# Altium schematic sheet HydrophoneGroup1FilterAndAmpCircuit.SchDoc
size C
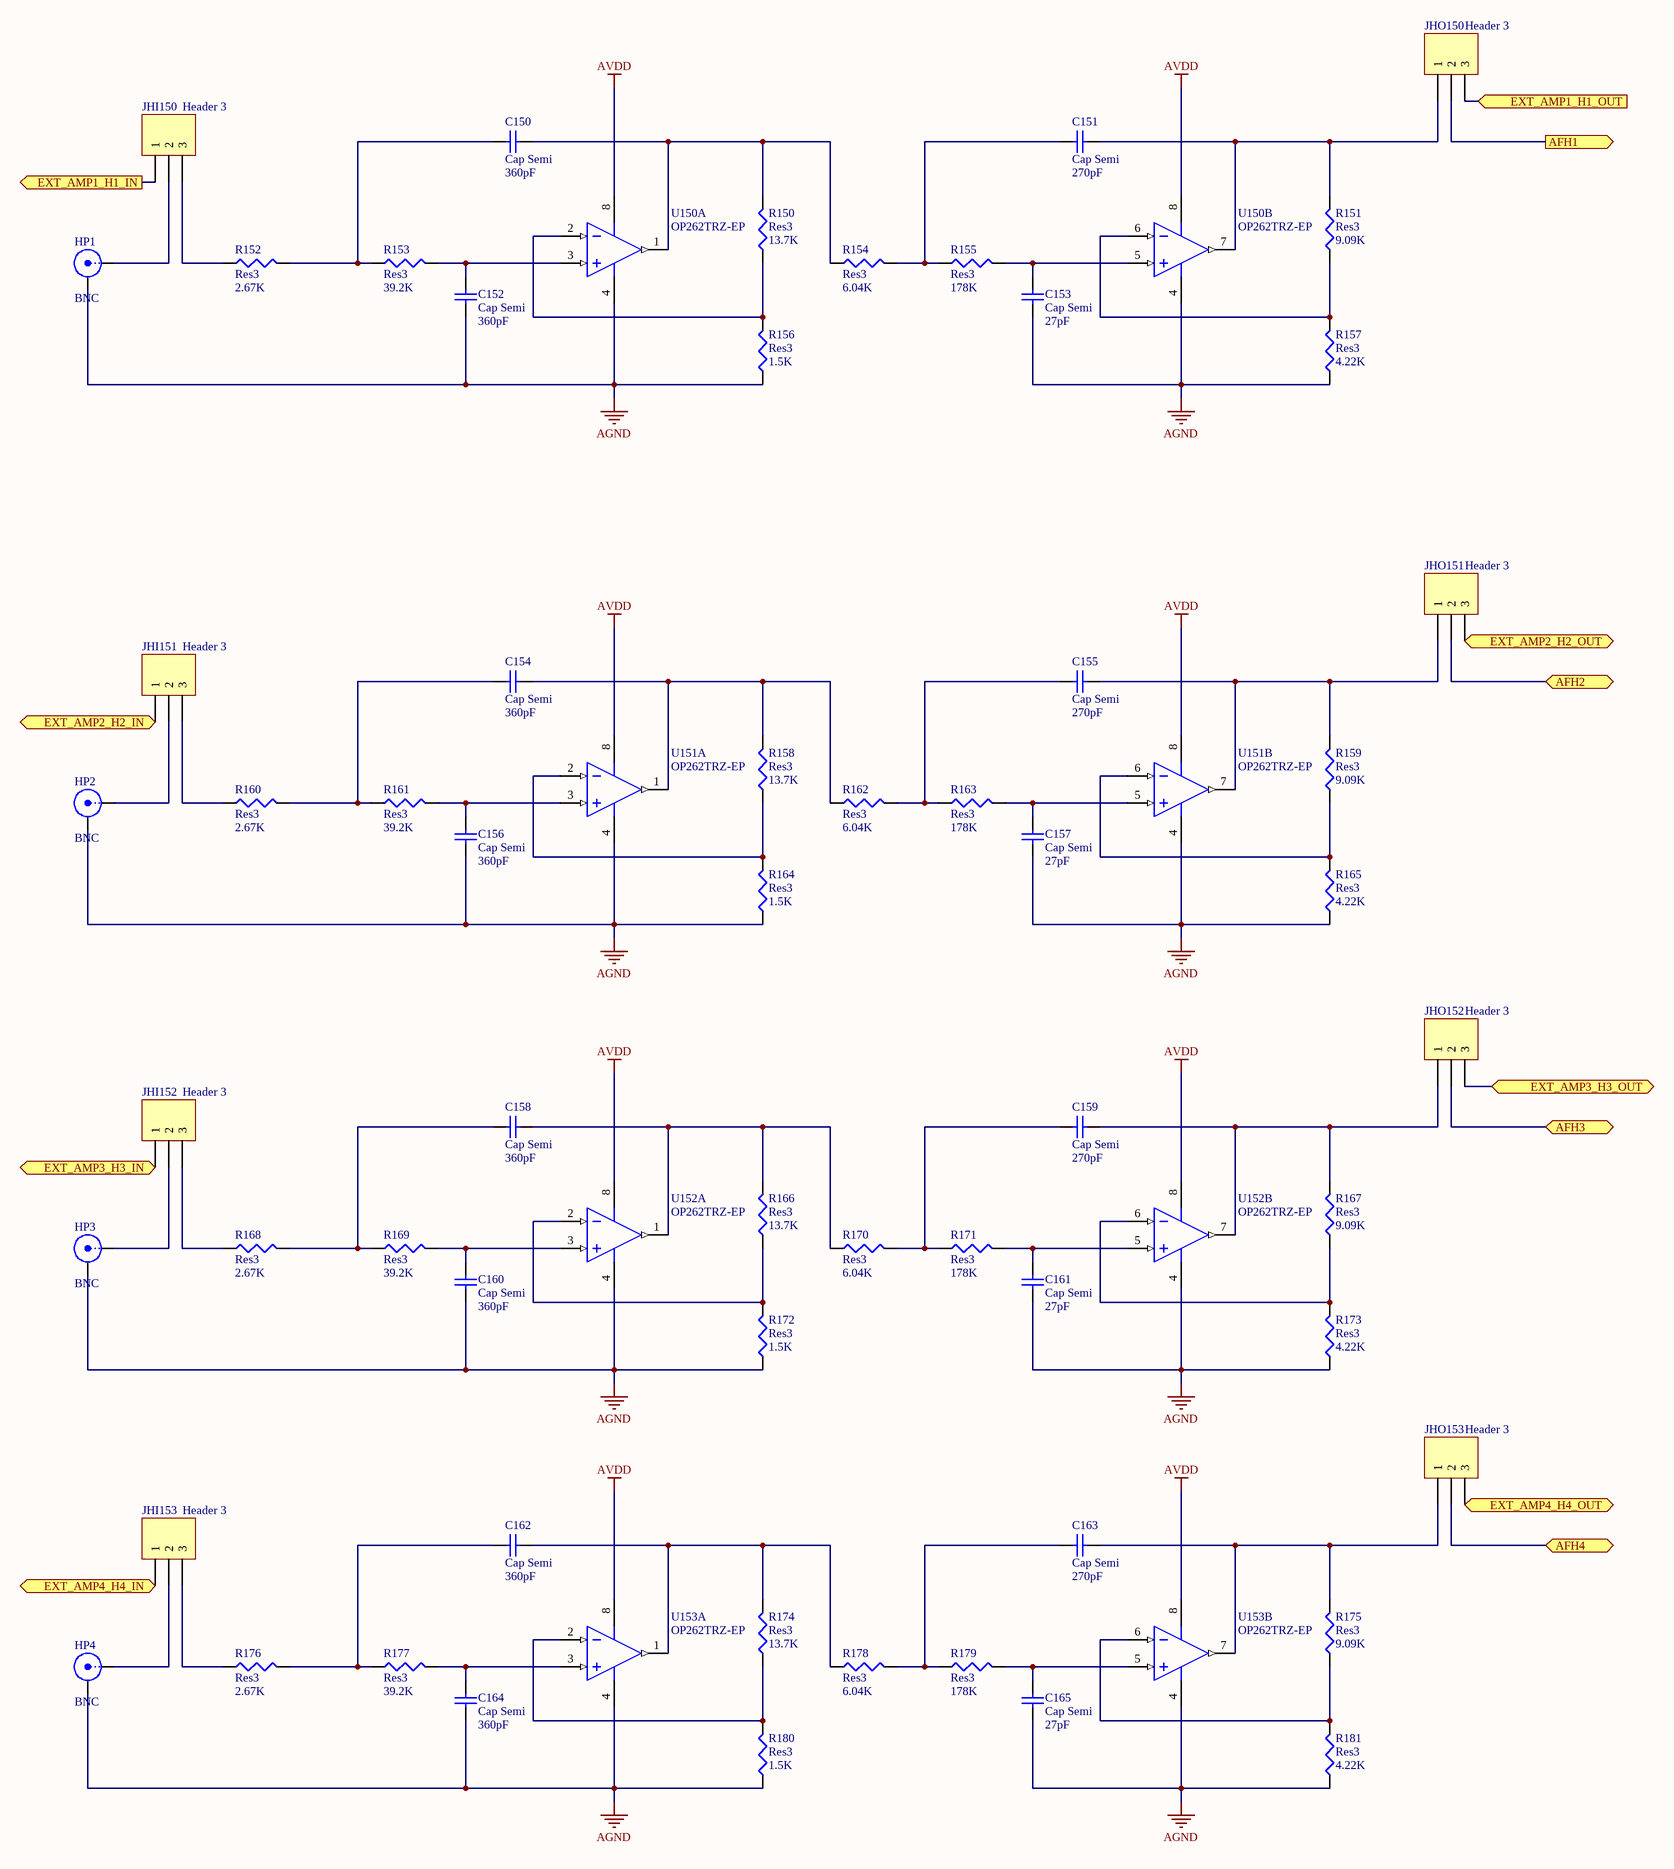
[diagram p0: HydrophoneGroup1FilterAndAmpCircuit.SchDoc]

## Parts
C150  Cap Semi  value 360pF  [1608[0603]]
C151  Cap Semi  value 270pF  [1608[0603]]
C152  Cap Semi  value 360pF  [1608[0603]]
C153  Cap Semi  value 27pF  [1608[0603]]
C154  Cap Semi  value 360pF  [1608[0603]]
C155  Cap Semi  value 270pF  [1608[0603]]
C156  Cap Semi  value 360pF  [1608[0603]]
C157  Cap Semi  value 27pF  [1608[0603]]
C158  Cap Semi  value 360pF  [1608[0603]]
C159  Cap Semi  value 270pF  [1608[0603]]
C160  Cap Semi  value 360pF  [1608[0603]]
C161  Cap Semi  value 27pF  [1608[0603]]
C162  Cap Semi  value 360pF  [1608[0603]]
C163  Cap Semi  value 270pF  [1608[0603]]
C164  Cap Semi  value 360pF  [1608[0603]]
C165  Cap Semi  value 27pF  [1608[0603]]
HP1  BNC  [BNC_RA CON]
HP2  BNC  [BNC_RA CON]
HP3  BNC  [BNC_RA CON]
HP4  BNC  [BNC_RA CON]
JHI150  Header 3  [HDR1X3]
JHI151  Header 3  [HDR1X3]
JHI152  Header 3  [HDR1X3]
JHI153  Header 3  [HDR1X3]
JHO150  Header 3  [HDR1X3]
JHO151  Header 3  [HDR1X3]
JHO152  Header 3  [HDR1X3]
JHO153  Header 3  [HDR1X3]
R150  Res3  value 13.7K  [J1-0603]
R151  Res3  value 9.09K  [J1-0603]
R152  Res3  value 2.67K  [J1-0603]
R153  Res3  value 39.2K  [J1-0603]
R154  Res3  value 6.04K  [J1-0603]
R155  Res3  value 178K  [J1-0603]
R156  Res3  value 1.5K  [J1-0603]
R157  Res3  value 4.22K  [J1-0603]
R158  Res3  value 13.7K  [J1-0603]
R159  Res3  value 9.09K  [J1-0603]
R160  Res3  value 2.67K  [J1-0603]
R161  Res3  value 39.2K  [J1-0603]
R162  Res3  value 6.04K  [J1-0603]
R163  Res3  value 178K  [J1-0603]
R164  Res3  value 1.5K  [J1-0603]
R165  Res3  value 4.22K  [J1-0603]
R166  Res3  value 13.7K  [J1-0603]
R167  Res3  value 9.09K  [J1-0603]
R168  Res3  value 2.67K  [J1-0603]
R169  Res3  value 39.2K  [J1-0603]
R170  Res3  value 6.04K  [J1-0603]
R171  Res3  value 178K  [J1-0603]
R172  Res3  value 1.5K  [J1-0603]
R173  Res3  value 4.22K  [J1-0603]
R174  Res3  value 13.7K  [J1-0603]
R175  Res3  value 9.09K  [J1-0603]
R176  Res3  value 2.67K  [J1-0603]
R177  Res3  value 39.2K  [J1-0603]
R178  Res3  value 6.04K  [J1-0603]
R179  Res3  value 178K  [J1-0603]
R180  Res3  value 1.5K  [J1-0603]
R181  Res3  value 4.22K  [J1-0603]
U150  OP262TRZ-EP  [ADI-R-8_N]  (parts A,B of 2)
U151  OP262TRZ-EP  [ADI-R-8_N]  (parts A,B of 2)
U152  OP262TRZ-EP  [ADI-R-8_N]  (parts A,B of 2)
U153  OP262TRZ-EP  [ADI-R-8_N]  (parts A,B of 2)

## Ports
AFH1 (out), AFH2, AFH3, AFH4, EXT_AMP1_H1_IN (out), EXT_AMP1_H1_OUT (in), EXT_AMP2_H2_IN, EXT_AMP2_H2_OUT, EXT_AMP3_H3_IN, EXT_AMP3_H3_OUT, EXT_AMP4_H4_IN, EXT_AMP4_H4_OUT

## Nets
AGND: C152.1 C153.1 C156.1 C157.1 C160.1 C161.1 C164.1 C165.1 HP1.2(Y) HP2.2(Y) HP3.2(Y) HP4.2(Y) R156.1 R157.1 R164.1 R165.1 R172.1 R173.1 R180.1 R181.1 U150.4(-V) U151.4(-V) U152.4(-V) U153.4(-V)
AVDD: U150.8(+V) U151.8(+V) U152.8(+V) U153.8(+V)
AFH1: JHO150.2 ; port AFH1
AFH2: JHO151.2 ; port AFH2
AFH3: JHO152.2 ; port AFH3
AFH4: JHO153.2 ; port AFH4
EXT_AMP1_H1_IN: JHI150.1 ; port EXT_AMP1_H1_IN
EXT_AMP1_H1_OUT: JHO150.3 ; port EXT_AMP1_H1_OUT
EXT_AMP2_H2_IN: JHI151.1 ; port EXT_AMP2_H2_IN
EXT_AMP2_H2_OUT: JHO151.3 ; port EXT_AMP2_H2_OUT
EXT_AMP3_H3_IN: JHI152.1 ; port EXT_AMP3_H3_IN
EXT_AMP3_H3_OUT: JHO152.3 ; port EXT_AMP3_H3_OUT
EXT_AMP4_H4_IN: JHI153.1 ; port EXT_AMP4_H4_IN
EXT_AMP4_H4_OUT: JHO153.3 ; port EXT_AMP4_H4_OUT
NetC150_1: C150.1 R152.2 R153.1
NetC150_2: C150.2 R150.2 R154.1 U150.1(OUT_A)
NetC151_1: C151.1 R154.2 R155.1
NetC151_2: C151.2 JHO150.1 R151.2 U150.7(OUT_B)
NetC152_2: C152.2 R153.2 U150.3(+IN_A)
NetC153_2: C153.2 R155.2 U150.5(+IN_B)
NetC154_1: C154.1 R160.2 R161.1
NetC154_2: C154.2 R158.2 R162.1 U151.1(OUT_A)
NetC155_1: C155.1 R162.2 R163.1
NetC155_2: C155.2 JHO151.1 R159.2 U151.7(OUT_B)
NetC156_2: C156.2 R161.2 U151.3(+IN_A)
NetC157_2: C157.2 R163.2 U151.5(+IN_B)
NetC158_1: C158.1 R168.2 R169.1
NetC158_2: C158.2 R166.2 R170.1 U152.1(OUT_A)
NetC159_1: C159.1 R170.2 R171.1
NetC159_2: C159.2 JHO152.1 R167.2 U152.7(OUT_B)
NetC160_2: C160.2 R169.2 U152.3(+IN_A)
NetC161_2: C161.2 R171.2 U152.5(+IN_B)
NetC162_1: C162.1 R176.2 R177.1
NetC162_2: C162.2 R174.2 R178.1 U153.1(OUT_A)
NetC163_1: C163.1 R178.2 R179.1
NetC163_2: C163.2 JHO153.1 R175.2 U153.7(OUT_B)
NetC164_2: C164.2 R177.2 U153.3(+IN_A)
NetC165_2: C165.2 R179.2 U153.5(+IN_B)
NetHP1_1: HP1.1(X) JHI150.2
NetHP2_1: HP2.1(X) JHI151.2
NetHP3_1: HP3.1(X) JHI152.2
NetHP4_1: HP4.1(X) JHI153.2
NetJHI150_3: JHI150.3 R152.1
NetJHI151_3: JHI151.3 R160.1
NetJHI152_3: JHI152.3 R168.1
NetJHI153_3: JHI153.3 R176.1
NetR150_1: R150.1 R156.2 U150.2(-IN_A)
NetR151_1: R151.1 R157.2 U150.6(-IN_B)
NetR158_1: R158.1 R164.2 U151.2(-IN_A)
NetR159_1: R159.1 R165.2 U151.6(-IN_B)
NetR166_1: R166.1 R172.2 U152.2(-IN_A)
NetR167_1: R167.1 R173.2 U152.6(-IN_B)
NetR174_1: R174.1 R180.2 U153.2(-IN_A)
NetR175_1: R175.1 R181.2 U153.6(-IN_B)

## Library data of the parts
C150-C165 = Cap Semi: Capacitor (Semiconductor SIM Model); Published: 8-Jun-2000; LatestRevisionDate: 29-May-2009; LatestRevisionNote: IPC-7351 Footprint Added.; PackageReference: C1206; Publisher: Altium Limited; PackageDescription: Chip Capacitor
HP1-HP4 = BNC: BNC Elbow Connector; LatestRevisionDate: 17-Jul-2002; LatestRevisionNote: Re-released for DXP Platform.; Publisher: Altium Limited
JHI150-JHI153 JHO150-JHO153 = Header 3: Header, 3-Pin; LatestRevisionDate: 17-Jul-2002; LatestRevisionNote: Re-released for DXP Platform.; Publisher: Altium Limited
R150-R181 = Res3: Resistor; Published: 8-Jun-2000; LatestRevisionDate: 29-May-2009; LatestRevisionNote: IPC-7351 Footprint Added.; PackageReference: J1-0603; Publisher: Altium Limited; PackageDescription: Chip Resistor
U150-U153 = OP262TRZ-EP: Double Channel Wide Bandwidth Operational Amplifier, 15 MHz BW, 13 V/us SR, Military, 8-pin SOIC (R-8), Tube; Generic Part Number: OP262; Manufacturer: Analog Devices; Amplifiers Per Package: 2; Input Bias Current: 260nA; Input Offset Voltage: 25uV; Iq/Amp: 775uA; Slew Rate: 13V/us; Small Signal Bandwidth: 15MHz; V Span Max: 12V; V Span Min: 2.7V; DatasheetVersion: Rev. G; PackageVersion: 060506-A; PackageReference: R-8; PackageDescription: 8-Pin Standard Small Outline Package, Body 3.9 x 4.9 mm, Pitch 1.27 mm; Supplier 1: Digi-Key; Supplier Part Number 1: OP262TRZ-EP-ND; Supplier 2: Newark; Supplier Part Number 2: 85R9009; Packing: Tube; Mounting Technology: Surface Mount; Code_JEDEC: MS-012-AA; PartNumber: OP262TRZ-EP; ComponentLink1Description: Manufacturer URL; ComponentLink1URL: http://www.analog.com/en/index.html; ComponentLink2Description: Datasheet; ComponentLink2URL: http://www.analog.com/static/imported-files/data_sheets/OP162_262_462.pdf; ComponentLink3Description: Package Specification; ComponentLink3URL: http://www.analog.com/static/imported-files/packages/PKG_PDF/SOIC_Narrow%20(R)/R_8.pdf